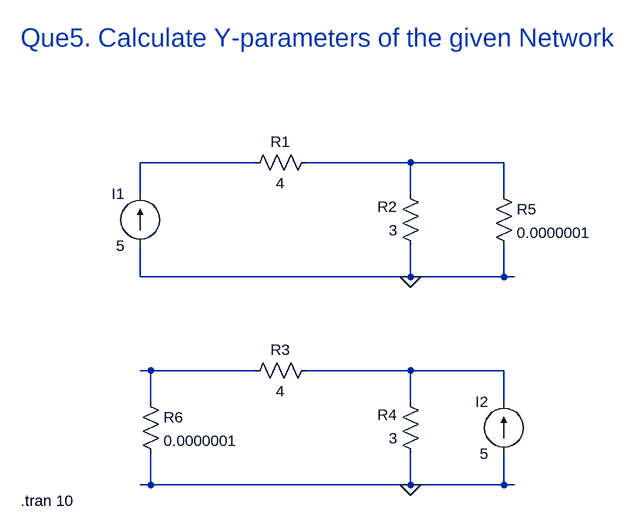
[diagram p0: schematic 5_Dheerendra_23EE019_AC_Two_port.asc]
5_Dheerendra_23EE019_AC_Two_port.asc, the LTspice schematic file:
Version 4
SHEET 1 912 712
WIRE 272 176 96 176
WIRE 512 176 352 176
WIRE 656 176 512 176
WIRE 96 224 96 176
WIRE 512 224 512 176
WIRE 656 224 656 176
WIRE 96 352 96 304
WIRE 512 352 512 304
WIRE 512 352 96 352
WIRE 656 352 656 304
WIRE 656 352 512 352
WIRE 672 352 656 352
WIRE 112 496 96 496
WIRE 272 496 112 496
WIRE 512 496 352 496
WIRE 656 496 512 496
WIRE 112 544 112 496
WIRE 512 544 512 496
WIRE 656 544 656 496
WIRE 112 672 112 624
WIRE 112 672 96 672
WIRE 512 672 512 624
WIRE 512 672 112 672
WIRE 656 672 656 624
WIRE 656 672 512 672
WIRE 672 672 656 672
FLAG 512 352 0
FLAG 512 672 0
SYMBOL res 368 160 R90
WINDOW 0 0 56 VBottom 2
WINDOW 3 32 56 VTop 2
SYMATTR InstName R1
SYMATTR Value 4
SYMBOL res 528 320 R180
WINDOW 0 36 76 Left 2
WINDOW 3 36 40 Left 2
SYMATTR InstName R2
SYMATTR Value 3
SYMBOL res 368 480 R90
WINDOW 0 0 56 VBottom 2
WINDOW 3 32 56 VTop 2
SYMATTR InstName R3
SYMATTR Value 4
SYMBOL res 528 640 R180
WINDOW 0 36 76 Left 2
WINDOW 3 36 40 Left 2
SYMATTR InstName R4
SYMATTR Value 3
SYMBOL current 96 304 R180
WINDOW 0 24 80 Left 2
WINDOW 3 24 0 Left 2
WINDOW 123 0 0 Left 0
WINDOW 39 0 0 Left 0
SYMATTR InstName I1
SYMATTR Value 5
SYMBOL current 656 624 R180
WINDOW 0 24 80 Left 2
WINDOW 3 24 0 Left 2
WINDOW 123 0 0 Left 0
WINDOW 39 0 0 Left 0
SYMATTR InstName I2
SYMATTR Value 5
SYMBOL res 640 208 R0
SYMATTR InstName R5
SYMATTR Value 0.0000001
SYMBOL res 96 528 R0
SYMATTR InstName R6
SYMATTR Value 0.0000001
TEXT -88 -16 Left 4 ;Que5. Calculate Y-parameters of the given Network
TEXT -88 696 Left 2 !.tran 10

The netlist it stands for:
* 5_Dheerendra_23EE019_AC_Two_port.asc
R1 N002 N001 4
R2 0 N002 3
R3 N004 N003 4
R4 0 N004 3
I1 0 N001 5
I2 0 N004 5
R5 N002 0 0.0000001
R6 N003 0 0.0000001
* Que5. Calculate Y-parameters of the given Network
.tran 10
.backanno
.end